# EAGLE schematic OpenPixelNode (EAGLE 6.5.0)
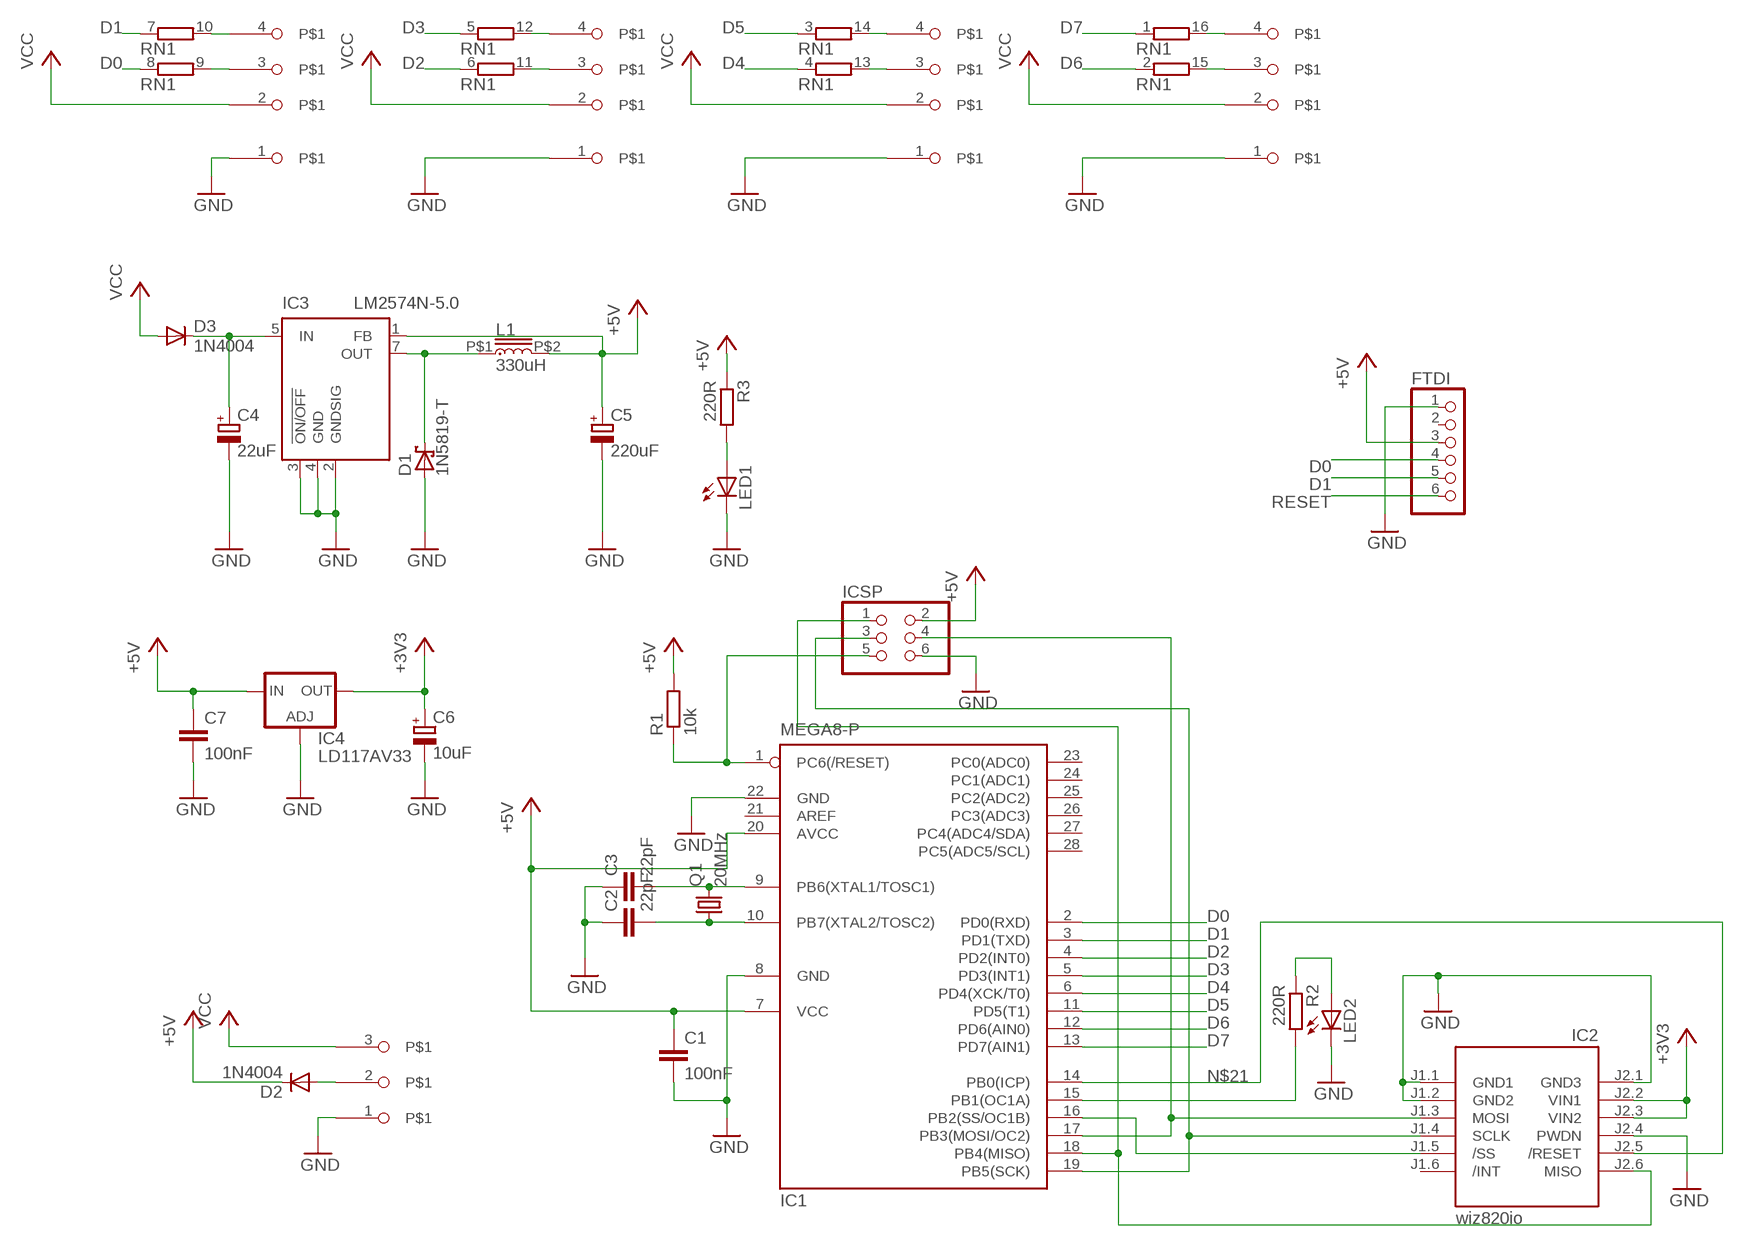
[diagram p0: schematic, sheet 1]

## Parts
C1  100nF  C-EU025-025X050  [C025-025X050]
C2  22pF  C-EU025-025X050  [C025-025X050]
C3  22pF  C-EU025-025X050  [C025-025X050]
C4  22uF  CPOL-EUE2.5-6  [E2,5-6]
C5  220uF  CPOL-EUE2.5-6  [E2,5-6]
C6  10uF  CPOL-EUE2.5-6  [E2,5-6]
C7  100nF  C-EU025-025X050  [C025-025X050]
D1  1N5819-T  [DO41-7.6]
D2  1N4004  [DO41-10]
D3  1N4004  [DO41-10]
FTDI  PINHD-1X6  [1X06]
IC1  MEGA8-P  [DIL28-3]
IC2  wiz820io  WIZ820IO_DEVICE'DUAL-IN-LINE'  [WIZ820IO]
IC3  LM2574N-5.0  [DIL08]
IC4  LD117AV33  [TO220L1]
ICSP  PINHD-2X3  [2X03]
L1  330uH  13R334C  [13R334C]
LED1  LED3MM  [LED3MM]
LED2  LED3MM  [LED3MM]
Q1  20MHz  CRYSTALHC49S  [HC49/S]
R1  10k  R-EU_0207/10  [0207/10]
R2  220R  R-EU_0207/10  [0207/10]
R3  220R  R-EU_0207/10  [0207/10]
RN1  8R-P  [DIL16]
U$1  691322110004  [691322110004]
U$2  691322110004  [691322110004]
U$3  691322110004  [691322110004]
U$4  691322110004  [691322110004]
U$5  CTB9358/3  [CTB9358/3]

## Nets
+3V3: C6.+ IC2.J2.2(VIN1) IC2.J2.3(VIN2) IC4.2(OUT)
+5V: C1.1 C5.+ C7.1 D2.C FTDI.3 IC1.7(VCC) IC1.20(AVCC) IC3.1(FB) IC4.3(IN) ICSP.2 L1.P$2 R1.2 R3.1
D0: FTDI.4 IC1.2(PD0(RXD)) RN1.8
D1: FTDI.5 IC1.3(PD1(TXD)) RN1.7
D2: IC1.4(PD2(INT0)) RN1.6
D3: IC1.5(PD3(INT1)) RN1.5
D4: IC1.6(PD4(XCK/T0)) RN1.4
D5: IC1.11(PD5(T1)) RN1.3
D6: IC1.12(PD6(AIN0)) RN1.2
D7: IC1.13(PD7(AIN1)) RN1.1
GND: C1.2 C2.1 C3.1 C4.- C5.- C6.- C7.2 D1.A FTDI.1 IC1.8(GND) IC1.22(GND) IC2.J1.1(GND1) IC2.J1.2(GND2) IC2.J2.1(GND3) IC2.J2.4(PWDN) IC3.2(GNDSIG) IC3.3(!ON/OFF) IC3.4(GND) IC4.1(ADJ) ICSP.6 LED1.K(C) LED2.K(C) U$1.1 U$2.1 U$3.1 U$4.1 U$5.1
N$1: LED1.A R3.2
N$2: C3.2 IC1.9(PB6(XTAL1/TOSC1)) Q1.2
N$3: C2.2 IC1.10(PB7(XTAL2/TOSC2)) Q1.1
N$4: IC1.16(PB2(SS/OC1B)) IC2.J1.5(/SS)
N$5: IC1.18(PB4(MISO)) IC2.J2.6(MISO) ICSP.1
N$6: D2.A U$5.2
N$7: IC1.17(PB3(MOSI/OC2)) IC2.J1.3(MOSI) ICSP.4
N$8: LED2.A R2.1
N$9: C4.+ D3.C IC3.5(IN)
N$10: D1.C IC3.7(OUT) L1.P$1
N$13: RN1.11 U$2.3
N$14: RN1.12 U$2.4
N$15: RN1.13 U$3.3
N$16: RN1.14 U$3.4
N$17: RN1.15 U$4.3
N$18: RN1.16 U$4.4
N$19: RN1.10 U$1.4
N$20: RN1.9 U$1.3
N$21: IC1.14(PB0(ICP)) IC2.J2.5(/RESET)
N$22: IC1.15(PB1(OC1A)) R2.2
RESET: FTDI.6 IC1.1(PC6(/RESET)) ICSP.5 R1.1
SCK: IC1.19(PB5(SCK)) IC2.J1.4(SCLK) ICSP.3
VCC: D3.A U$1.2 U$2.2 U$3.2 U$4.2 U$5.3
Unconnected: FTDI.2 IC1.21(AREF) IC1.23(PC0(ADC0)) IC1.24(PC1(ADC1)) IC1.25(PC2(ADC2)) IC1.26(PC3(ADC3)) IC1.27(PC4(ADC4/SDA)) IC1.28(PC5(ADC5/SCL)) IC2.J1.6(/INT)

## Library data of the parts
C1-C3 C7 = rcl:C-EU: CAPACITOR, European symbol
C4-C6 = rcl:CPOL-EU: POLARIZED CAPACITOR, European symbol
D1 = diode:1N581*: 1.0A SCHOTTKY BARRIER RECTIFIER Source: http://www.diodes.com/datasheets/ds23001.pdf
D2 D3 = diode:1N4004: DIODE general purpose rectifier, 1 A
FTDI = pinhead:PINHD-1X6: PIN HEADER
IC1 = atmel:MEGA8-P: MICROCONTROLLER 8 Kbytes FLASH, 1 kbytes SRAM, 512 bytes EEPROM, USART, 4-channel 10 bit ADC, 2-channel 8 bit ADC Pin compatible with Atmega48, ATMega88, ATMega168 Source: avr.lbr; OC_FARNELL: unknown; OC_NEWARK: unknown
IC2 = Wiz820io:WIZ820IO_DEVICE: WIZnet, WIZ820io plug in module incl. W5200 chip and MagJack
IC3 = linear:LM2574?-*: SIMPLE SWITCHER 0.5A Step-Down Voltage Regulator Source: http://cache.national.com/ds/LM/LM2574.pdf
IC4 = v-reg:LD117A?*: Low drop fixed and adjustable positive voltage regulators 1 A Source: http://www.st.com/stonline/products/literature/ds/7194/ld1117axx.pdf
ICSP = pinhead:PINHD-2X3: PIN HEADER
L1 = inductors:13R334C
LED1 LED2 = led:LED: LED OSRAM: - CHIPLED LG R971, LG N971, LY N971, LG Q971, LY Q971, LO R971, LY R971 LH N974, LH R974 LS Q976, LO Q976, LY Q976 LO Q996 - Hyper CHIPLED LW Q18S LB Q993, LB Q99A, LB R99A - SideLED LS A670, LO A670, LY A670, LG A670, LP A670 LB A673, LV A673, LT A673, LW A673 LH A674 LY A675 LS A676, LA A676, LO A676, LY A676, LW A676 LS A679, LY A679, LG A679 - Hyper Micro SIDELED® LS Y876, LA Y876, LO Y876, LY Y876 LT Y87S - SmartLED LW L88C, LW L88S LB L89C, LB L89S, LG L890 LS L89K, LO L89K, LY L89K LS L896, LA L896, LO L896, LY L896 - TOPLED LS T670, LO T670, LY T670, LG T670, LP T670 LSG T670, LSP T670, LSY T670, LOP T670, LYG T670 LG T671, LOG T671, LSG T671 LB T673, LV T673, LT T673, LW T673 LH T674 LS T676, LA T676, LO T676, LY T676, LB T676, LH T676, LSB T676, LW T676 LB T67C, LV T67C, LT T67C, LS T67K, LO T67K, LY T67K, LW E67C LS E67B, LA E67B, LO E67B, LY E67B, LB E67C, LV E67C, LT E67C LW T67C LS T679, LY T679, LG T679 LS T770, LO T770, LY T770, LG T770, LP T770 LB T773, LV T773, LT T773, LW T773 LH T774 LS E675, LA E675, LY E675, LS T675 LS T776, LA T776, LO T776, LY T776, LB T776 LHGB T686 LT T68C, LB T68C - Hyper Mini TOPLED® LB M676 - Mini TOPLED Santana® LG M470 LS M47K, LO M47K, LY M47K Source: http://www.osram.convergy.de LUXEON: - LUMILED® LXK2-PW12-R00, LXK2-PW12-S00, LXK2-PW14-U00, LXK2-PW14-V00 LXK2-PM12-R00, LXK2-PM12-S00, LXK2-PM14-U00 LXK2-PE12-Q00, LXK2-PE12-R00, LXK2-PE12-S00, LXK2-PE14-T00, LXK2-PE14-U00 LXK2-PB12-K00, LXK2-PB12-L00, LXK2-PB12-M00, LXK2-PB14-N00, LXK2-PB14-P00, LXK2-PB14-Q00 LXK2-PR12-L00, LXK2-PR12-M00, LXK2-PR14-Q00, LXK2-PR14-R00 LXK2-PD12-Q00, LXK2-PD12-R00, LXK2-PD12-S00 LXK2-PH12-R00, LXK2-PH12-S00 LXK2-PL12-P00, LXK2-PL12-Q00, LXK2-PL12-R00 Source: www.luxeon.com KINGBRIGHT: KA-3528ASYC Source: www.kingbright.com
Q1 = crystal:CRYSTAL: CRYSTAL; OC_FARNELL: 1667008; OC_NEWARK: unknown
R1-R3 = rcl:R-EU_: RESISTOR, European symbol
RN1 = resistor-dil:8R-P: DIL RESISTOR; OC_FARNELL: unknown; OC_NEWARK: unknown
U$1-U$4 = con-wurth:691322110004
U$5 = con-wurth:CTB9358/3